# Altium schematic sheet FPGA_ADC3.SchDoc
size A4
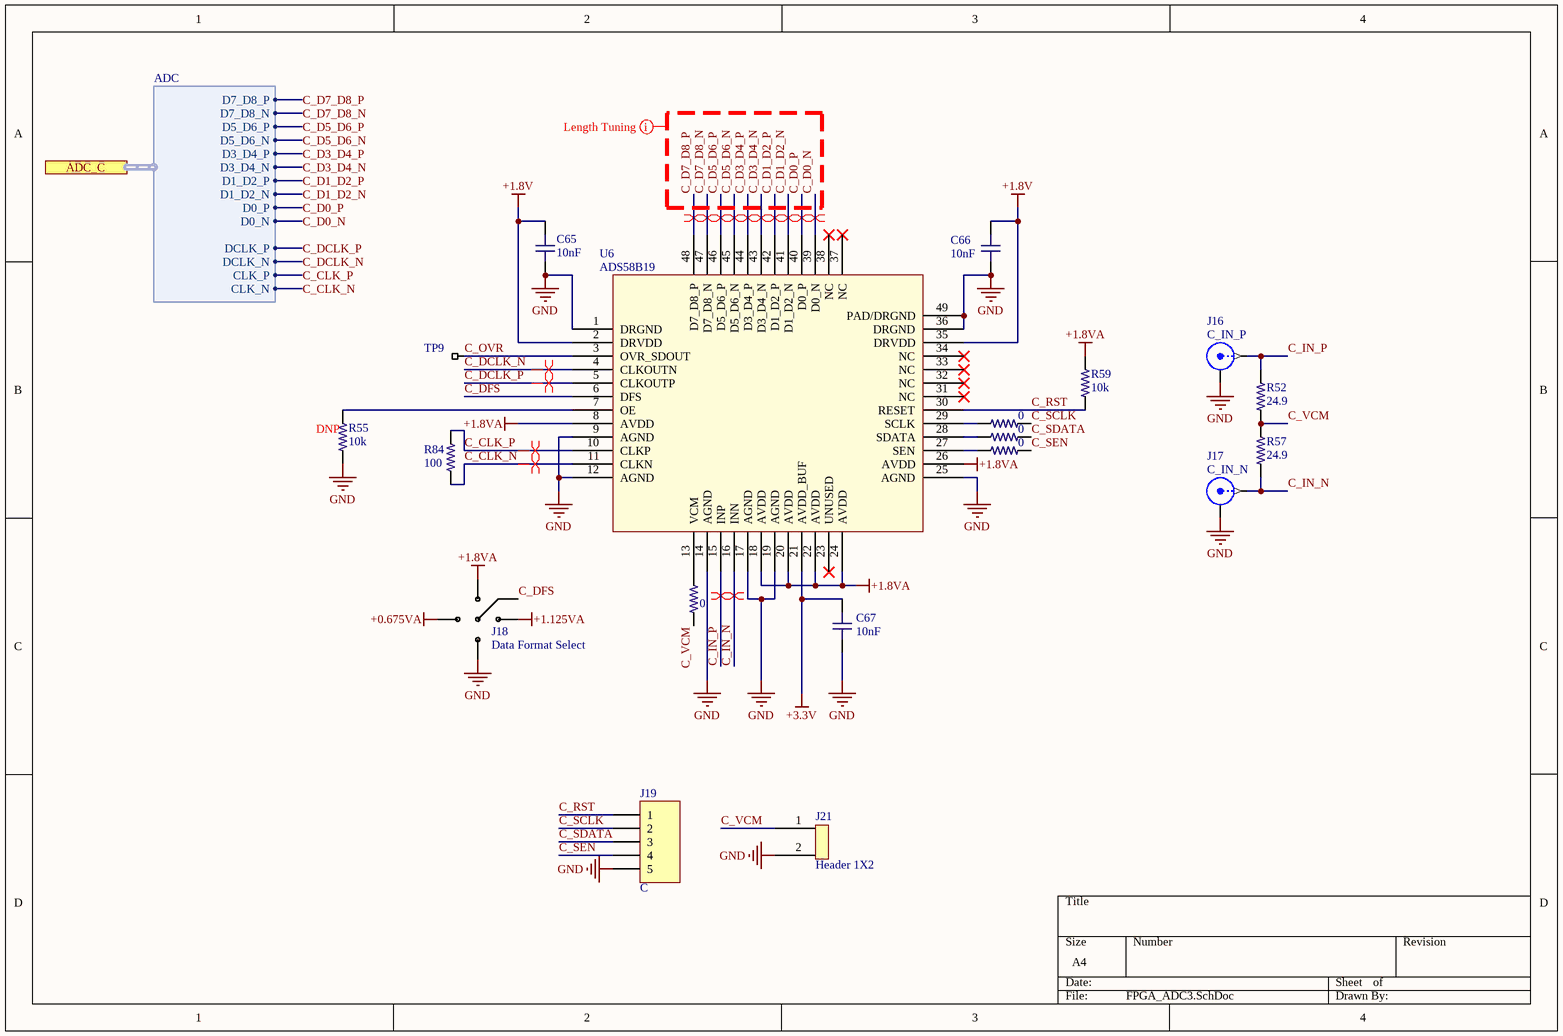
[diagram p0: FPGA_ADC3.SchDoc]

## Parts
C65  value 10nF  [C0603-HIGH-DENSITY]  (hidden comment: C0603 10nF 50V X7R)
C66  value 10nF  [C0603-HIGH-DENSITY]  (hidden comment: C0603 10nF 50V X7R)
C67  value 10nF  [C0603-HIGH-DENSITY]  (hidden comment: C0603 10nF 50V X7R)
J16  C_IN_P  [SMA Edge Launch (Horizontal)]
J17  C_IN_N  [SMA Edge Launch (Horizontal)]
J18  Data Format Select  [4P Jumper]
J19  C  [HDR1X5]
J21  Header 1X2  [Header 1x2 TH Pitch 2.54mm]
R52  value 24.9  [R0603-HIGH-DENSITY]  (hidden comment: RC0603FR-0724R9L)
R53  value 0  [R0603-IPC]  (hidden comment: R0603 0)
R54  value 0  [R0603-IPC]  (hidden comment: R0603 0)
R55  value 10k  [R0603-IPC-10K]  (hidden comment: R0603 10K 1%)
R56  value 0  [R0603-IPC]  (hidden comment: R0603 0)
R57  value 24.9  [R0603-HIGH-DENSITY]  (hidden comment: RC0603FR-0724R9L)
R58  value 0  [R0603-IPC]  (hidden comment: R0603 0)
R59  value 10k  [R0603-IPC-10K]  (hidden comment: R0603 10K 1%)
R84  value 100  [R0402-HIGH-DENSITY]  (hidden comment: R0402 100R 1%)
TP9  Testpoint_SMT  [TESTPOINT_SMT]  (value not drawn)  (no BOM)
U6  ADS58B19  [VQFN48]

## Ports
ADC_C (harness ADC)

## Harnesses
ADC: D7_D8_P, D7_D8_N, D5_D6_P, D5_D6_N, D3_D4_P, D3_D4_N, D1_D2_P, D1_D2_N, D0_P, D0_N, CLK_P, CLK_N, DCLK_P, DCLK_N

## Nets
+0.675VA: J18.4
+1.8V: C65.1 C66.1 U6.2(DRVDD) U6.35(DRVDD)
+1.8VA: J18.1 R59.2 U6.8(AVDD) U6.18(AVDD) U6.20(AVDD) U6.22(AVDD) U6.24(AVDD) U6.26(AVDD)
+1.125VA: J18.2
+3.3V: C67.1 U6.21(AVDD_BUF)
GND: C65.2 C66.2 C67.2 J16.2(Y) J17.2(Y) J18.3 J19.5 J21.2 R55.1 U6.1(DRGND) U6.9(AGND) U6.12(AGND) U6.14(AGND) U6.17(AGND) U6.19(AGND) U6.25(AGND) U6.36(DRGND) U6.49(PAD/DRGND)
C_CLK_N: R84.1 U6.11(CLKN) ; port ADC_C.CLK_N
C_CLK_P: R84.2 U6.10(CLKP) ; port ADC_C.CLK_P
C_D0_N: U6.39(D0_N) ; port ADC_C.D0_N
C_D0_P: U6.40(D0_P) ; port ADC_C.D0_P
C_D1_D2_N: U6.41(D1_D2_N) ; port ADC_C.D1_D2_N
C_D1_D2_P: U6.42(D1_D2_P) ; port ADC_C.D1_D2_P
C_D3_D4_N: U6.43(D3_D4_N) ; port ADC_C.D3_D4_N
C_D3_D4_P: U6.44(D3_D4_P) ; port ADC_C.D3_D4_P
C_D5_D6_N: U6.45(D5_D6_N) ; port ADC_C.D5_D6_N
C_D5_D6_P: U6.46(D5_D6_P) ; port ADC_C.D5_D6_P
C_D7_D8_N: U6.47(D7_D8_N) ; port ADC_C.D7_D8_N
C_D7_D8_P: U6.48(D7_D8_P) ; port ADC_C.D7_D8_P
C_DCLK_N: U6.4(CLKOUTN) ; port ADC_C.DCLK_N
C_DCLK_P: U6.5(CLKOUTP) ; port ADC_C.DCLK_P
C_DFS: J18.5 U6.6(DFS)
C_IN_N: J17.1(X) R57.1 U6.16(INN)
C_IN_P: J16.1(X) R52.2 U6.15(INP)
C_OVR: TP9.1 U6.3(OVR_SDOUT)
C_RST: J19.1 R59.1 U6.30(RESET)
C_SCLK: J19.2 R53.2
C_SDATA: J19.3 R54.2
C_SEN: J19.4 R56.2
C_VCM: J21.1 R52.1 R57.2 R58.2
NetR53_1: R53.1 U6.29(SCLK)
NetR54_1: R54.1 U6.28(SDATA)
NetR55_2: R55.2 U6.7(OE)
NetR56_1: R56.1 U6.27(SEN)
NetR58_1: R58.1 U6.13(VCM)

Not connected (* = marked no-connect by the designer): U6 23(UNUSED)* 31(NC)* 32(NC)* 33(NC)* 34(NC)* 37(NC)* 38(NC)*

## Layout directives
differential pair: C_D0_N, C_D0_P, C_D1_D2_N, C_D1_D2_P, C_D3_D4_N, C_D3_D4_P, C_D5_D6_N, C_D5_D6_P, C_D7_D8_N, C_D7_D8_P
differential pair; differential pair class AnalogIn: C_IN_N, C_IN_P
differential pair; differential pair class ADC_CLK: C_CLK_N, C_CLK_P, C_DCLK_N, C_DCLK_P
net class ADC_DATA - 150mil; net class ADC_DATA_C: C_D0_N, C_D0_P, C_D1_D2_N, C_D1_D2_P, C_D3_D4_N, C_D3_D4_P, C_D5_D6_N, C_D5_D6_P, C_D7_D8_N, C_D7_D8_P

## Notes on the sheet
- (near R55) DNP

## Library data of the parts
C65-C67 = C0603 10nF 50V X7R: CAP CER 10000PF 50V X7R 0603; EIA Code: X7R; Max. Voltage: 50V; Features: Soft Termination; Supplier 1: Digi-Key; Supplier Part Number 1: 490-10892-1-ND
J16 J17 = SMA: SMA Connector; Supplier 1: Digi-Key; Supplier Part Number 1: A97594-ND
J18 = 4P Jumper: 0603 4 Way Solder Jumper
J19 = Header 5: Header, 5-Pin; LatestRevisionDate: 17-Jul-2002; LatestRevisionNote: Re-released for DXP Platform.; Publisher: Altium Limited
R52 R57 = R0603 24.9R 1%: Chip Resistor, 0603, 24.9 ohms, 0.1W; Supplier 1: Digi-Key; Supplier 2: Mouser; Supplier Part Number 1: 311-24.9HRCT-ND; Supplier Part Number 2: 603-RC0603FR-0724R9L
R53 R54 R56 R58 = R0603 0: RES SMD 0 OHM JUMPER 1/10W 0603; Supplier 1: Digi-Key; Supplier Part Number 1: RMCF0603ZT0R00CT-ND
R55 R59 = R0603 10K 1%: RES SMD 10K OHM 1% 1/10W 0603; Supplier 1: Digi-Key; Supplier Part Number 1: RMCF0603FT10K0CT-ND
R84 = R0402 100R 1%: Chip Resistor, 0402, 100 ohms, 1%, 1/16 W; Supplier 1: Digi-Key; Supplier Part Number 1: 311-100LRCT-ND
TP9 = Testpoint_SMT: SMT Test Point
U6 = ADS58B19: Single ADC Pipelined 250Msps 9-bit Parallel/LVDS 48-Pin VQFN; Supplier 1: Digi-Key; Supplier 2: Mouser; Supplier Part Number 1: 296-28296-1-ND; Supplier Part Number 2: 595-ADS58B19IRGZT